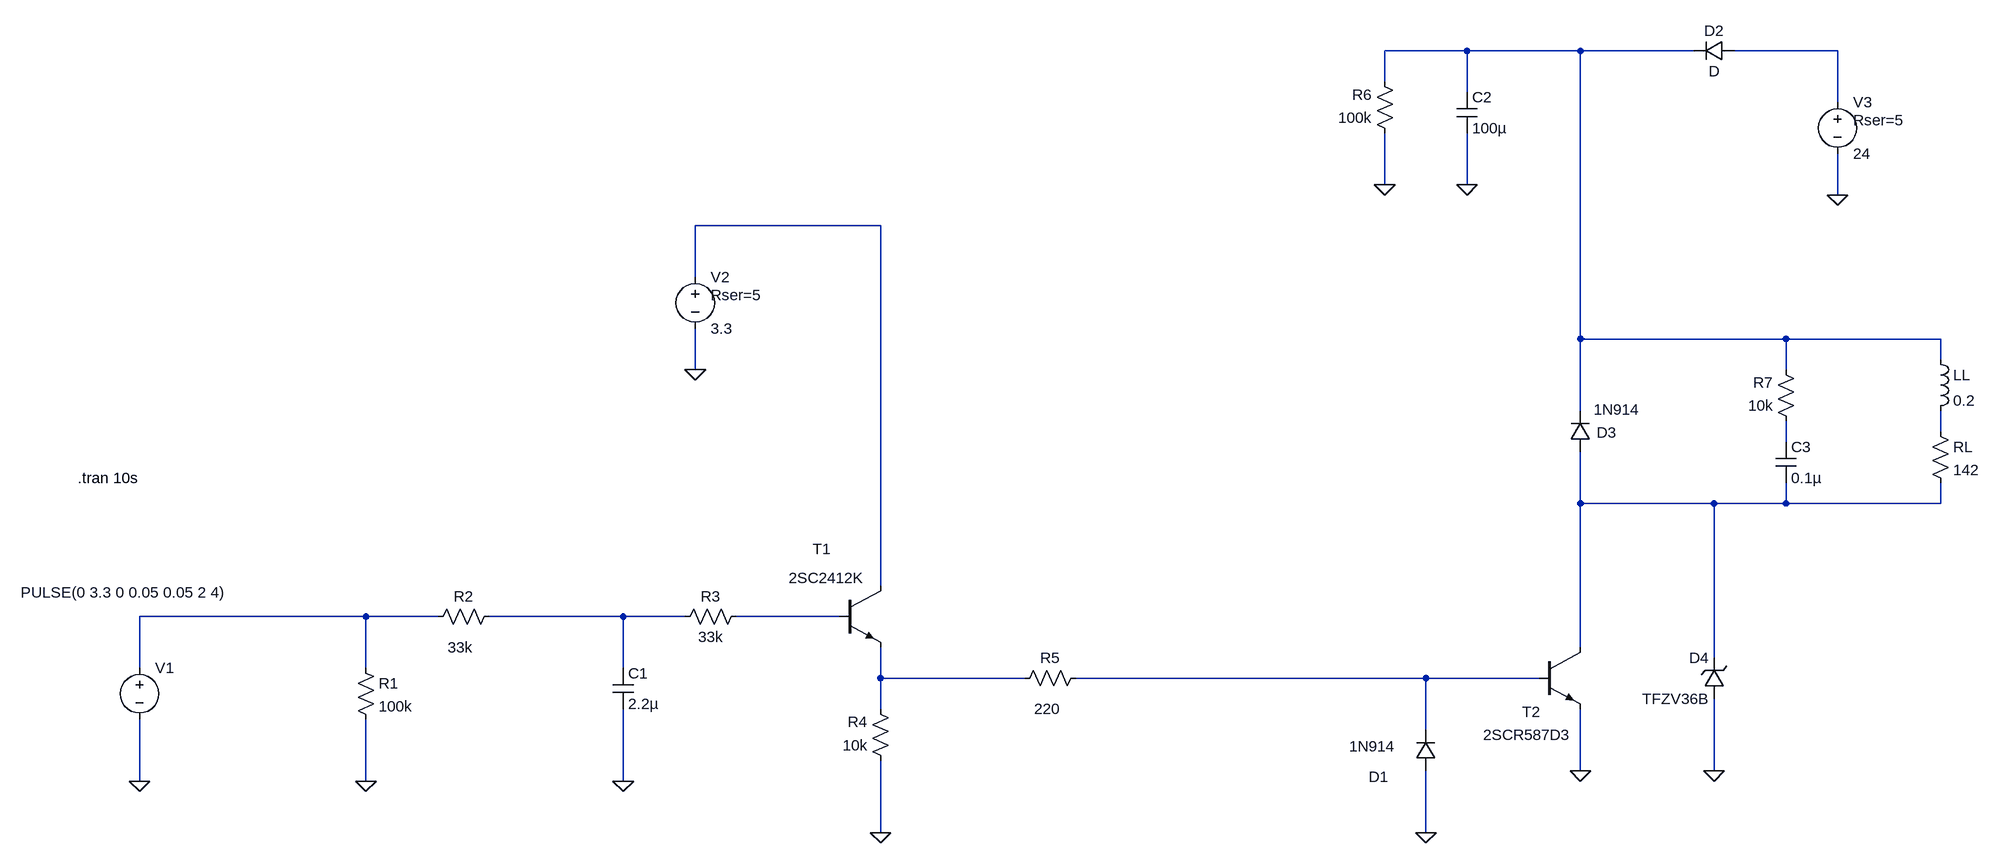
[diagram p0: schematic InductiveLoadSwitch_v2.asc]
InductiveLoadSwitch_v2.asc, the LTspice schematic file:
Version 4
SHEET 1 2724 680
WIRE 1920 -848 1792 -848
WIRE 2096 -848 1920 -848
WIRE 2272 -848 2096 -848
WIRE 2496 -848 2336 -848
WIRE 1792 -800 1792 -848
WIRE 1920 -784 1920 -848
WIRE 2496 -768 2496 -848
WIRE 1792 -640 1792 -720
WIRE 1920 -640 1920 -720
WIRE 2496 -624 2496 -688
WIRE 1008 -576 720 -576
WIRE 720 -496 720 -576
WIRE 2096 -400 2096 -848
WIRE 2416 -400 2096 -400
WIRE 2656 -400 2416 -400
WIRE 2656 -368 2656 -400
WIRE 720 -352 720 -416
WIRE 2416 -352 2416 -400
WIRE 2096 -288 2096 -400
WIRE 2656 -256 2656 -288
WIRE 2416 -240 2416 -272
WIRE 2096 -144 2096 -224
WIRE 2304 -144 2096 -144
WIRE 2416 -144 2416 -176
WIRE 2416 -144 2304 -144
WIRE 2656 -144 2656 -176
WIRE 2656 -144 2416 -144
WIRE 1008 -16 1008 -576
WIRE 208 32 -144 32
WIRE 320 32 208 32
WIRE 608 32 400 32
WIRE 704 32 608 32
WIRE 944 32 784 32
WIRE 2096 80 2096 -144
WIRE 2304 96 2304 -144
WIRE -144 112 -144 32
WIRE 208 112 208 32
WIRE 608 112 608 32
WIRE 1008 128 1008 80
WIRE 1232 128 1008 128
WIRE 1856 128 1312 128
WIRE 2032 128 1856 128
WIRE 1008 176 1008 128
WIRE 1856 208 1856 128
WIRE 2096 272 2096 176
WIRE 2304 272 2304 160
WIRE -144 288 -144 192
WIRE 208 288 208 192
WIRE 608 288 608 176
WIRE 1008 368 1008 256
WIRE 1856 368 1856 272
FLAG -144 288 0
FLAG 2096 272 0
FLAG 2496 -624 0
FLAG 2304 272 0
FLAG 720 -352 0
FLAG 1856 368 0
FLAG 608 288 0
FLAG 1008 368 0
FLAG 1920 -640 0
FLAG 1792 -640 0
FLAG 208 288 0
SYMBOL npn 2032 80 R0
WINDOW 0 -26 100 Left 2
WINDOW 3 -87 136 Left 2
SYMATTR InstName T2
SYMATTR Value 2SCR587D3
SYMBOL diode 2112 -224 R180
WINDOW 0 -40 30 Left 2
WINDOW 3 -76 66 Left 2
SYMATTR InstName D3
SYMATTR Value 1N914
SYMBOL ind 2640 -384 R0
SYMATTR InstName LL
SYMATTR Value 0.2
SYMBOL res 2640 -272 R0
SYMATTR InstName RL
SYMATTR Value 142
SYMBOL voltage -144 96 R0
WINDOW 3 -185 -102 Left 2
WINDOW 123 0 0 Left 0
WINDOW 39 0 0 Left 0
SYMATTR Value PULSE(0 3.3 0 0.05 0.05 2 4)
SYMATTR InstName V1
SYMBOL voltage 2496 -784 R0
WINDOW 123 0 0 Left 0
WINDOW 39 24 44 Left 2
SYMATTR SpiceLine Rser=5
SYMATTR InstName V3
SYMATTR Value 24
SYMBOL diode 2336 -864 R90
WINDOW 0 0 32 VBottom 2
WINDOW 3 32 32 VTop 2
SYMATTR InstName D2
SYMBOL zener 2320 160 R180
WINDOW 0 24 64 Left 2
WINDOW 3 24 0 Left 2
SYMATTR InstName D4
SYMATTR Value TFZV36B
SYMBOL npn 944 -16 R0
WINDOW 0 -41 -57 Left 2
WINDOW 3 -79 -12 Left 2
SYMATTR InstName T1
SYMATTR Value 2SC2412K
SYMBOL voltage 720 -512 R0
WINDOW 123 0 0 Left 0
WINDOW 39 24 44 Left 2
SYMATTR SpiceLine Rser=5
SYMATTR InstName V2
SYMATTR Value 3.3
SYMBOL diode 1872 272 R180
WINDOW 0 74 -9 Left 2
WINDOW 3 64 38 Left 2
SYMATTR InstName D1
SYMATTR Value 1N914
SYMBOL res 1328 112 R90
WINDOW 0 0 56 VBottom 2
WINDOW 3 48 61 VTop 2
SYMATTR InstName R5
SYMATTR Value 220
SYMBOL res 800 16 R90
WINDOW 0 0 56 VBottom 2
WINDOW 3 32 56 VTop 2
SYMATTR InstName R3
SYMATTR Value 33k
SYMBOL res 416 16 R90
WINDOW 0 0 56 VBottom 2
WINDOW 3 48 61 VTop 2
SYMATTR InstName R2
SYMATTR Value 33k
SYMBOL cap 592 112 R0
SYMATTR InstName C1
SYMATTR Value 2.2µ
SYMBOL res 1024 272 R180
WINDOW 0 36 76 Left 2
WINDOW 3 36 40 Left 2
SYMATTR InstName R4
SYMATTR Value 10k
SYMBOL cap 1904 -784 R0
SYMATTR InstName C2
SYMATTR Value 100µ
SYMBOL res 1808 -704 R180
WINDOW 0 36 76 Left 2
WINDOW 3 36 40 Left 2
SYMATTR InstName R6
SYMATTR Value 100k
SYMBOL res 2432 -256 R180
WINDOW 0 36 76 Left 2
WINDOW 3 36 40 Left 2
SYMATTR InstName R7
SYMATTR Value 10k
SYMBOL cap 2400 -240 R0
SYMATTR InstName C3
SYMATTR Value 0.1µ
SYMBOL res 192 96 R0
SYMATTR InstName R1
SYMATTR Value 100k
TEXT -240 -184 Left 2 !.tran 10s

The netlist it stands for:
* InductiveLoadSwitch_v2.asc
Q§T2 N006 N011 0 0 2SCR587D3
D3 N006 N001 1N914
LL N001 N004 0.2
RL N004 N006 142
V1 N007 0 PULSE(0 3.3 0 0.05 0.05 2 4)
V3 N002 0 24 Rser=5
D2 N002 N001 D
D4 0 N006 TFZV36B
Q§T1 N003 N009 N010 0 2SC2412K
V2 N003 0 3.3 Rser=5
D1 0 N011 1N914
R5 N011 N010 220
R3 N009 N008 33k
R2 N008 N007 33k
C1 N008 0 2.2µ
R4 0 N010 10k
C2 N001 0 100µ
R6 0 N001 100k
R7 N005 N001 10k
C3 N005 N006 0.1µ
R1 N007 0 100k
.model D D
.lib standard.dio
.model NPN NPN
.model PNP PNP
.lib standard.bjt
.tran 10s
.backanno
.end